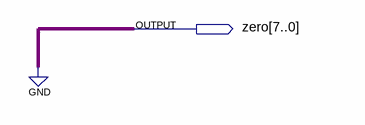
[diagram p0: schematic sheet]
// Quartus schematic zero.bdf as structural Verilog: 0 symbols, 1 pins
module zero (
  output [7:0] zero
);


  assign zero = {8{1'b0}};
endmodule
